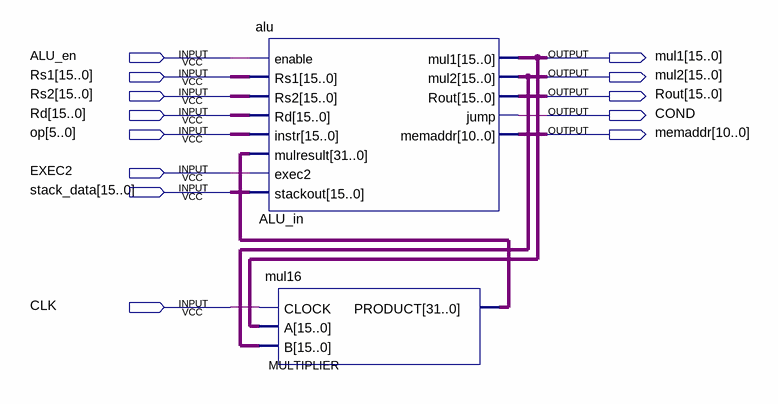
[diagram p0: schematic sheet]
// Quartus schematic ALU_top.bdf as structural Verilog: 2 symbols, 13 pins
module ALU_top (
  input  ALU_en,
  input  [15:0] Rs1,
  input  [15:0] Rs2,
  input  [15:0] Rd,
  input  [5:0] op,
  input  EXEC2,
  input  [15:0] stack_data,
  input  CLK,
  output [15:0] mul1,
  output [15:0] mul2,
  output [15:0] Rout,
  output COND,
  output [10:0] memaddr
);

  wire [31:0] MULTIPLIER_product;

  alu ALU_in (
    .enable(ALU_en), .Rs1(Rs1), .Rs2(Rs2), .Rd(Rd), .instr(op), .mulresult(MULTIPLIER_product),
    .exec2(EXEC2), .stackout(stack_data), .mul1(mul1), .mul2(mul2), .Rout(Rout), .jump(COND),
    .memaddr(memaddr));
  mul16 MULTIPLIER (.CLOCK(CLK), .A(mul1), .B(mul2), .PRODUCT(MULTIPLIER_product));
endmodule
